# Altium project zipa-testbed-sensor-circuit.PrjPcb
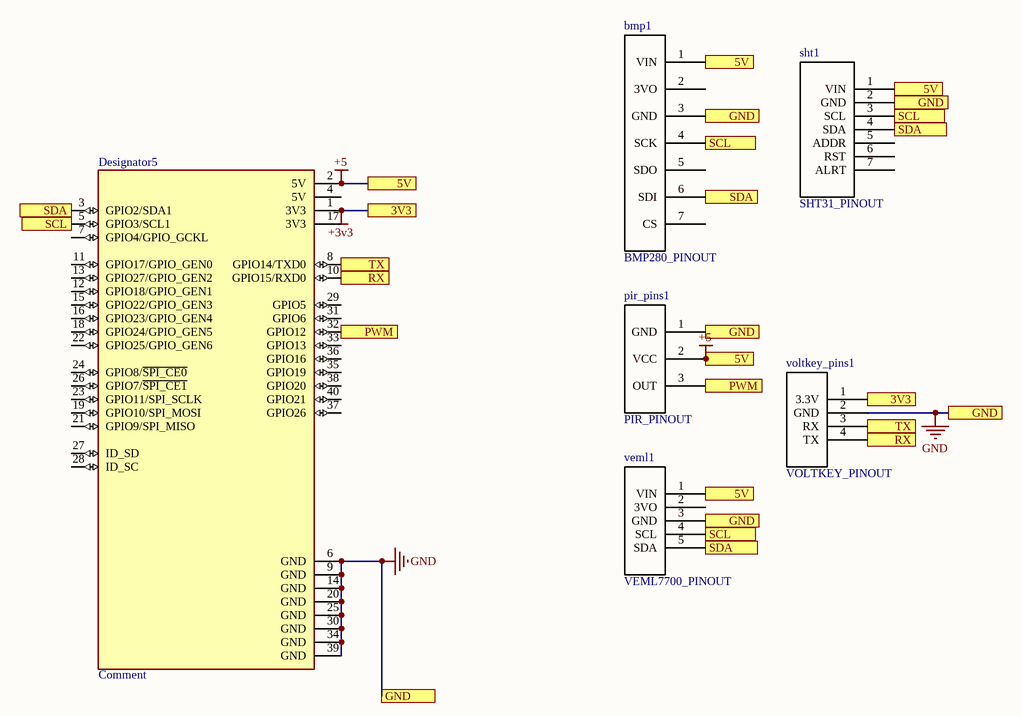
[diagram p0: board.SchDoc]
1 sheet, 6 parts. Net scope: flat (ports and power ports of the same name join across sheets).
Board file: board_pcbv3.PcbDoc

## Sheet board.SchDoc
size A; SheetNumber: 1; SheetTotal: 1

### Parts
bmp1  BMP280_PINOUT  [bmp280_footprint]
Designator5  Comment  [MODULE_RASPBERRY_PI_4B_4GB]
pir_pins1  PIR_PINOUT  [pir_footprint]
sht1  SHT31_PINOUT  [sht31_footprint]
veml1  VEML7700_PINOUT  [veml7700_footprint]
voltkey_pins1  VOLTKEY_PINOUT  [voltkey_footprint]

### Ports
3V3 (see board[2A]), 3V3 (see board[4B]), 5V (see board[2A], board[3A], board[3B], board[3C]), 5V (see board[2A], board[3A], board[3B], board[4A]), 5V (see board[2A], board[3A], board[3C], board[4A]), 5V (see board[2A], board[3B], board[3C], board[4A]), 5V (see board[3A], board[3B], board[3C], board[4A]), GND (see board[2C], board[3A], board[3B], board[3C], board[4A]), GND (see board[2C], board[3A], board[3B], board[3C], board[4B]), GND (see board[2C], board[3A], board[3B], board[4A], board[4B]), GND (see board[2C], board[3A], board[3C], board[4A], board[4B]), GND (see board[2C], board[3B], board[3C], board[4A], board[4B]), GND (see board[3A], board[3B], board[3C], board[4A], board[4B]), PWM (see board[2B]), PWM (see board[3B]), RX (see board[2B]), RX (see board[4B]), SCL (see board[1B], board[3A], board[3C]), SCL (see board[1B], board[3A], board[4A]), SCL (see board[1B], board[3C], board[4A]), SCL (see board[3A], board[3C], board[4A]), SDA (see board[1A], board[3A], board[3C]), SDA (see board[1A], board[3A], board[4A]), SDA (see board[1A], board[3C], board[4A]), SDA (see board[3A], board[3C], board[4A]), TX (see board[2B]), TX (see board[4B])

### Nets
+3v3: Designator5.1(3V3) voltkey_pins1.1(3.3V) ; port 3V3
+5: bmp1.1(VIN) Designator5.2(5V) pir_pins1.2(VCC) sht1.1(VIN) veml1.1(VIN) ; port 5V
GND: bmp1.3(GND) Designator5.6(GND) Designator5.9(GND) Designator5.14(GND) Designator5.20(GND) Designator5.25(GND) Designator5.30(GND) Designator5.34(GND) Designator5.39(GND) pir_pins1.1(GND) sht1.2(GND) veml1.3(GND) voltkey_pins1.2(GND) ; port GND
Netbmp1_4: bmp1.4(SCK) Designator5.5(GPIO3/SCL1) sht1.3(SCL) veml1.4(SCL) ; port SCL
Netbmp1_6: bmp1.6(SDI) Designator5.3(GPIO2/SDA1) sht1.4(SDA) veml1.5(SDA) ; port SDA
NetDesignator5_8: Designator5.8(GPIO14/TXD0) voltkey_pins1.3(RX) ; port TX
NetDesignator5_10: Designator5.10(GPIO15/RXD0) voltkey_pins1.4(TX) ; port RX
NetDesignator5_32: Designator5.32(GPIO12) pir_pins1.3(OUT) ; port PWM

Not connected (* = marked no-connect by the designer): bmp1 2(3VO) 5(SDO) 7(CS); Designator5 4(5V) 7(GPIO4/GPIO_GCKL) 11(GPIO17/GPIO_GEN0) 12(GPIO18/GPIO_GEN1) 13(GPIO27/GPIO_GEN2) 15(GPIO22/GPIO_GEN3) 16(GPIO23/GPIO_GEN4) 17(3V3) 18(GPIO24/GPIO_GEN5) 19(GPIO10/SPI_MOSI) 21(GPIO9/SPI_MISO) 22(GPIO25/GPIO_GEN6) 23(GPIO11/SPI_SCLK) 24(GPIO8/~{SPI_CE0}) 26(GPIO7/~{SPI_CE1}) 27(ID_SD) 28(ID_SC) 29(GPIO5) 31(GPIO6) 33(GPIO13) 35(GPIO19) 36(GPIO16) 37(GPIO26) 38(GPIO20) 40(GPIO21); sht1 5(ADDR) 6(RST) 7(ALRT); veml1 2(3VO)

### Library data of the parts
Designator5 = RASPBERRY_PI_4B_4GB: BCM2711 Raspberry Pi 4 Model B 4GB - ARMÂ® CortexÂ®-A72 MPU Embedded Evaluation Board; MP: RASPBERRY PI 4B/4GB; Price: None; MF: Raspberry Pi; Check_prices: https://www.snapeda.com/parts/RASPBERRY%20PI%204B/4GB/Raspberry+Pi/view-part/?ref=eda; Value: *; Purchase-URL: https://pricing.snapeda.com/search/part/RASPBERRY PI 4B/4GB/?ref=eda; Availability: In Stock; SnapEDA_Link: https://www.snapeda.com/parts/RASPBERRY%20PI%204B/4GB/Raspberry+Pi/view-part/?ref=snap; Package: None